# Altium project Guitar_Amplifier_(Class_D).PrjPcb
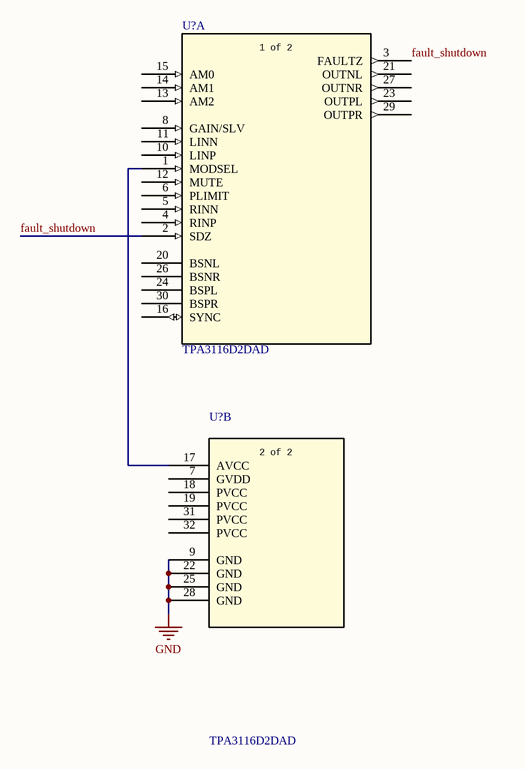
[diagram p0: Guitar_Preamp.SchDoc]
1 sheet, 2 parts. Net scope: global (net labels, ports and power ports of the same name join across sheets).

## Sheet Guitar_Preamp.SchDoc
size A4; SheetNumber: 1; SheetTotal: 1

### Parts
(Parts that share a designator on the sheet are numbered #1, #2 ... from top to bottom, then left to right.)
U?#1  TPA3116D2DAD  [DAD32_TEX]  (part A of 2)
U?#2  TPA3116D2DAD  [DAD32_TEX]  (part B of 2)

### Nets
GND: U?#2.9(GND) U?#2.22(GND) U?#2.25(GND) U?#2.28(GND)
fault_shutdown: U?#1.2(SDZ) U?#1.3(FAULTZ)
NetU?#1_1: U?#1.1(MODSEL) U?#2.17(AVCC)

Not connected (* = marked no-connect by the designer): U?#1 4(RINP) 5(RINN) 6(PLIMIT) 8(GAIN/SLV) 10(LINP) 11(LINN) 12(MUTE) 13(AM2) 14(AM1) 15(AM0) 16(SYNC) 20(BSNL) 21(OUTNL) 23(OUTPL) 24(BSPL) 26(BSNR) 27(OUTNR) 29(OUTPR) 30(BSPR); U?#2 7(GVDD) 18(PVCC) 19(PVCC) 31(PVCC) 32(PVCC)

### Notes on the sheet
- (in symbol TPA3116D2DAD, part A) 1 of 2
- (in symbol TPA3116D2DAD, part B) 2 of 2

### Library data of the parts
U?#1 U?#2 = TPA3116D2DAD: 50-W stereo, 100-W mono, 4.5- to 26-V supply, analog input Class-D audio amplifier w/ SpeakerGuardâ„¢ 32-HTSSOP -40 to 85; Manufacturer_Name: Texas Instruments; Copyright: Copyright (C) 2025 Ultra Librarian. All rights reserved.; Manufacturer_Part_Number: TPA3116D2DAD; RefDes: RefDes; Type: Type